# Altium schematic sheet RK3588_DDR.SchDoc
size 594 x 420 mm; SheetNumber: 4; SheetTotal: 24
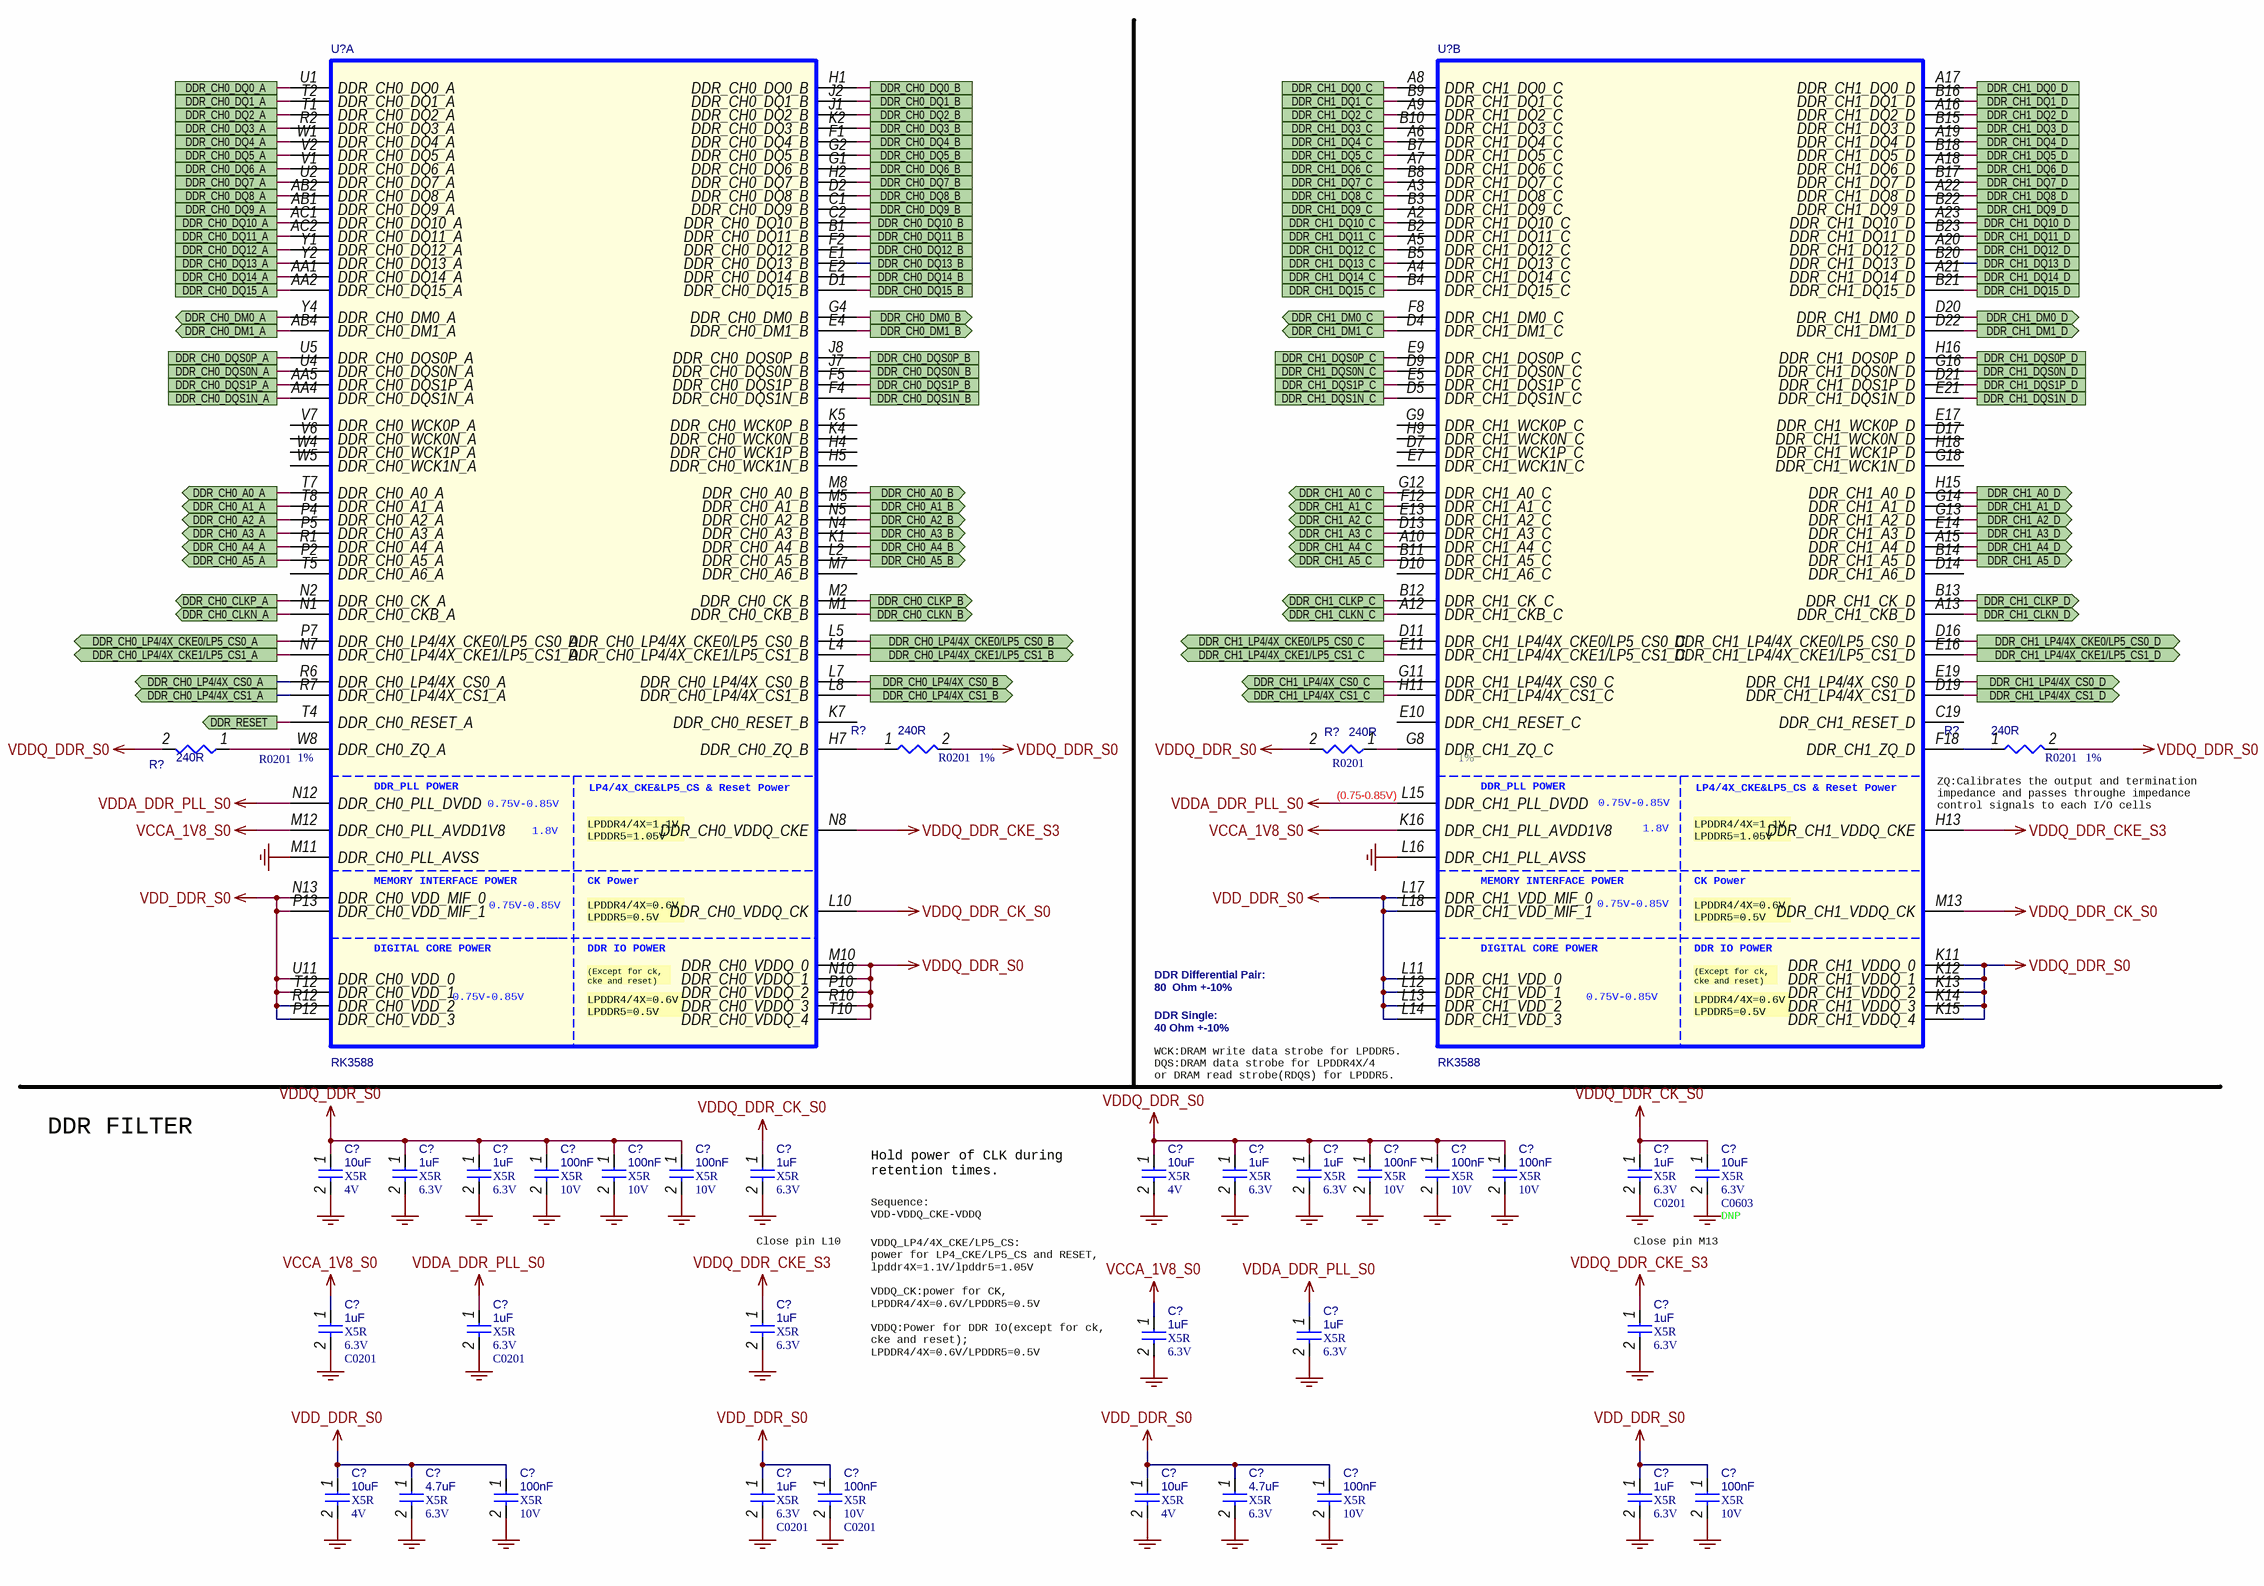
[diagram p0: RK3588_DDR.SchDoc]

## Parts
(Parts that share a designator on the sheet are numbered #1, #2 ... from top to bottom, then left to right.)
C?#1  10uF  Dielectric: X5R  Voltage: 4V  [C0402_BGA]
C?#2  1uF  Dielectric: X5R  Voltage: 6.3V  [C0201]
C?#3  1uF  Dielectric: X5R  Voltage: 6.3V  [C0201]
C?#4  100nF  Dielectric: X5R  Voltage: 10V  [C0201]
C?#5  100nF  Dielectric: X5R  Voltage: 10V  [C0201]
C?#6  100nF  Dielectric: X5R  Voltage: 10V  [C0201]
C?#7  1uF  Dielectric: X5R  Voltage: 6.3V  [C0201]
C?#8  10uF  Dielectric: X5R  Voltage: 4V  [C0402_BGA]
C?#9  1uF  Dielectric: X5R  Voltage: 6.3V  [C0201]
C?#10  1uF  Dielectric: X5R  Voltage: 6.3V  [C0201]
C?#11  100nF  Dielectric: X5R  Voltage: 10V  [C0201]
C?#12  100nF  Dielectric: X5R  Voltage: 10V  [C0201]
C?#13  100nF  Dielectric: X5R  Voltage: 10V  [C0201]
C?#14  1uF  Dielectric: X5R  Voltage: 6.3V  [C0201]
C?#15  10uF  Dielectric: X5R  Voltage: 6.3V  Option: DNP  [C0603]
C?#16  1uF  Dielectric: X5R  Voltage: 6.3V  [C0201]
C?#17  1uF  Dielectric: X5R  Voltage: 6.3V  [C0201]
C?#18  1uF  Dielectric: X5R  Voltage: 6.3V  [C0201]
C?#19  1uF  Dielectric: X5R  Voltage: 6.3V  [C0201]
C?#20  1uF  Dielectric: X5R  Voltage: 6.3V  [C0201]
C?#21  1uF  Dielectric: X5R  Voltage: 6.3V  [C0201]
C?#22  10uF  Dielectric: X5R  Voltage: 4V  [C0402_BGA]
C?#23  4.7uF  Dielectric: X5R  Voltage: 6.3V  [C0402_BGA]
C?#24  100nF  Dielectric: X5R  Voltage: 10V  [C0201]
C?#25  1uF  Dielectric: X5R  Voltage: 6.3V  [C0201]
C?#26  100nF  Dielectric: X5R  Voltage: 10V  [C0201]
C?#27  10uF  Dielectric: X5R  Voltage: 4V  [C0402_BGA]
C?#28  4.7uF  Dielectric: X5R  Voltage: 6.3V  [C0402_BGA]
C?#29  100nF  Dielectric: X5R  Voltage: 10V  [C0201]
C?#30  1uF  Dielectric: X5R  Voltage: 6.3V  [C0201]
C?#31  100nF  Dielectric: X5R  Voltage: 10V  [C0201]
R?#1  240R  Tolerance: 1%  PCB Footprint: R0201  [R0402]
R?#2  240R  Tolerance: 1%  PCB Footprint: R0201  [R0402]
R?#3  240R  Tolerance: 1%  PCB Footprint: R0201  [R0402]
R?#4  240R  Tolerance: 1%  PCB Footprint: R0201  [R0402]
U?#1  RK3588  [BGA1088_23R00X23R00X2R00]  (part A of 26)
U?#2  RK3588  [BGA1088_23R00X23R00X2R00]  (part B of 26)

## Ports
DDR_CH0_A0_A (out, see DRAM_LPDDR4X_200P_2X32bit[1B]), DDR_CH0_A0_B (out, see DRAM_LPDDR4X_200P_2X32bit[2B]), DDR_CH0_A1_A (out, see DRAM_LPDDR4X_200P_2X32bit[1B]), DDR_CH0_A1_B (out, see DRAM_LPDDR4X_200P_2X32bit[2B]), DDR_CH0_A2_A (out, see DRAM_LPDDR4X_200P_2X32bit[1B]), DDR_CH0_A2_B (out, see DRAM_LPDDR4X_200P_2X32bit[2B]), DDR_CH0_A3_A (out, see DRAM_LPDDR4X_200P_2X32bit[1B]), DDR_CH0_A3_B (out, see DRAM_LPDDR4X_200P_2X32bit[2B]), DDR_CH0_A4_A (out, see DRAM_LPDDR4X_200P_2X32bit[1B]), DDR_CH0_A4_B (out, see DRAM_LPDDR4X_200P_2X32bit[2B]), DDR_CH0_A5_A (out, see DRAM_LPDDR4X_200P_2X32bit[1B]), DDR_CH0_A5_B (out, see DRAM_LPDDR4X_200P_2X32bit[2B]), DDR_CH0_CLKN_A (out, see DRAM_LPDDR4X_200P_2X32bit[1B]), DDR_CH0_CLKN_B (out, see DRAM_LPDDR4X_200P_2X32bit[2B]), DDR_CH0_CLKP_A (out, see DRAM_LPDDR4X_200P_2X32bit[1B]), DDR_CH0_CLKP_B (out, see DRAM_LPDDR4X_200P_2X32bit[2B]), DDR_CH0_DM0_A (out, see DRAM_LPDDR4X_200P_2X32bit[1A]), DDR_CH0_DM0_B (out, see DRAM_LPDDR4X_200P_2X32bit[2A]), DDR_CH0_DM1_A (out, see DRAM_LPDDR4X_200P_2X32bit[1B]), DDR_CH0_DM1_B (out, see DRAM_LPDDR4X_200P_2X32bit[2B]), DDR_CH0_DQ0_A (see DRAM_LPDDR4X_200P_2X32bit[1A]), DDR_CH0_DQ0_B (see DRAM_LPDDR4X_200P_2X32bit[2A]), DDR_CH0_DQ1_A (see DRAM_LPDDR4X_200P_2X32bit[1A]), DDR_CH0_DQ1_B (see DRAM_LPDDR4X_200P_2X32bit[2A]), DDR_CH0_DQ2_A (see DRAM_LPDDR4X_200P_2X32bit[1A]), DDR_CH0_DQ2_B (see DRAM_LPDDR4X_200P_2X32bit[2A]), DDR_CH0_DQ3_A (see DRAM_LPDDR4X_200P_2X32bit[1A]), DDR_CH0_DQ3_B (see DRAM_LPDDR4X_200P_2X32bit[2A]), DDR_CH0_DQ4_A (see DRAM_LPDDR4X_200P_2X32bit[1A]), DDR_CH0_DQ4_B (see DRAM_LPDDR4X_200P_2X32bit[2A]), DDR_CH0_DQ5_A (see DRAM_LPDDR4X_200P_2X32bit[1A]), DDR_CH0_DQ5_B (see DRAM_LPDDR4X_200P_2X32bit[2A]), DDR_CH0_DQ6_A (see DRAM_LPDDR4X_200P_2X32bit[1A]), DDR_CH0_DQ6_B (see DRAM_LPDDR4X_200P_2X32bit[2A]), DDR_CH0_DQ7_A (see DRAM_LPDDR4X_200P_2X32bit[1A]), DDR_CH0_DQ7_B (see DRAM_LPDDR4X_200P_2X32bit[2A]), DDR_CH0_DQ8_A (see DRAM_LPDDR4X_200P_2X32bit[1A]), DDR_CH0_DQ8_B (see DRAM_LPDDR4X_200P_2X32bit[2A]), DDR_CH0_DQ9_A (see DRAM_LPDDR4X_200P_2X32bit[1A]), DDR_CH0_DQ9_B (see DRAM_LPDDR4X_200P_2X32bit[2A]), DDR_CH0_DQ10_A (see DRAM_LPDDR4X_200P_2X32bit[1A]), DDR_CH0_DQ10_B (see DRAM_LPDDR4X_200P_2X32bit[2A]), DDR_CH0_DQ11_A (see DRAM_LPDDR4X_200P_2X32bit[1A]), DDR_CH0_DQ11_B (see DRAM_LPDDR4X_200P_2X32bit[2A]), DDR_CH0_DQ12_A (see DRAM_LPDDR4X_200P_2X32bit[1A]), DDR_CH0_DQ12_B (see DRAM_LPDDR4X_200P_2X32bit[2A]), DDR_CH0_DQ13_A (see DRAM_LPDDR4X_200P_2X32bit[1A]), DDR_CH0_DQ13_B (see DRAM_LPDDR4X_200P_2X32bit[2A]), DDR_CH0_DQ14_A (see DRAM_LPDDR4X_200P_2X32bit[1A]), DDR_CH0_DQ14_B (see DRAM_LPDDR4X_200P_2X32bit[2A]), DDR_CH0_DQ15_A (see DRAM_LPDDR4X_200P_2X32bit[1A]), DDR_CH0_DQ15_B (see DRAM_LPDDR4X_200P_2X32bit[2A]), DDR_CH0_DQS0N_A (see DRAM_LPDDR4X_200P_2X32bit[1A]), DDR_CH0_DQS0N_B (see DRAM_LPDDR4X_200P_2X32bit[2A]), DDR_CH0_DQS0P_A (see DRAM_LPDDR4X_200P_2X32bit[1A]), DDR_CH0_DQS0P_B (see DRAM_LPDDR4X_200P_2X32bit[2A]), DDR_CH0_DQS1N_A (see DRAM_LPDDR4X_200P_2X32bit[1B]), DDR_CH0_DQS1N_B (see DRAM_LPDDR4X_200P_2X32bit[2B]), DDR_CH0_DQS1P_A (see DRAM_LPDDR4X_200P_2X32bit[1B]), DDR_CH0_DQS1P_B (see DRAM_LPDDR4X_200P_2X32bit[2B]), DDR_CH0_LP4/4X_CKE0/LP5_CS0_A (out, see DRAM_LPDDR4X_200P_2X32bit[3B]), DDR_CH0_LP4/4X_CKE0/LP5_CS0_B (out, see DRAM_LPDDR4X_200P_2X32bit[3B]), DDR_CH0_LP4/4X_CKE1/LP5_CS1_A (out, see DRAM_LPDDR4X_200P_2X32bit[3B]), DDR_CH0_LP4/4X_CKE1/LP5_CS1_B (out, see DRAM_LPDDR4X_200P_2X32bit[3B]), DDR_CH0_LP4/4X_CS0_A (out, see DRAM_LPDDR4X_200P_2X32bit[1B]), DDR_CH0_LP4/4X_CS0_B (out, see DRAM_LPDDR4X_200P_2X32bit[2B]), DDR_CH0_LP4/4X_CS1_A (out, see DRAM_LPDDR4X_200P_2X32bit[1B]), DDR_CH0_LP4/4X_CS1_B (out, see DRAM_LPDDR4X_200P_2X32bit[2B]), DDR_CH1_A0_C (out, see DRAM_LPDDR4X_200P_2X32bit[1C]), DDR_CH1_A0_D (out, see DRAM_LPDDR4X_200P_2X32bit[2C]), DDR_CH1_A1_C (out, see DRAM_LPDDR4X_200P_2X32bit[1C]), DDR_CH1_A1_D (out, see DRAM_LPDDR4X_200P_2X32bit[2C]), DDR_CH1_A2_C (out, see DRAM_LPDDR4X_200P_2X32bit[1C]), DDR_CH1_A2_D (out, see DRAM_LPDDR4X_200P_2X32bit[2C]), DDR_CH1_A3_C (out, see DRAM_LPDDR4X_200P_2X32bit[1C]), DDR_CH1_A3_D (out, see DRAM_LPDDR4X_200P_2X32bit[2C]), DDR_CH1_A4_C (out, see DRAM_LPDDR4X_200P_2X32bit[1C]), DDR_CH1_A4_D (out, see DRAM_LPDDR4X_200P_2X32bit[2C]), DDR_CH1_A5_C (out, see DRAM_LPDDR4X_200P_2X32bit[1D]), DDR_CH1_A5_D (out, see DRAM_LPDDR4X_200P_2X32bit[2D]), DDR_CH1_CLKN_C (out, see DRAM_LPDDR4X_200P_2X32bit[1D]), DDR_CH1_CLKN_D (out, see DRAM_LPDDR4X_200P_2X32bit[2D]), DDR_CH1_CLKP_C (out, see DRAM_LPDDR4X_200P_2X32bit[1D]), DDR_CH1_CLKP_D (out, see DRAM_LPDDR4X_200P_2X32bit[2D]), DDR_CH1_DM0_C (out, see DRAM_LPDDR4X_200P_2X32bit[1C]), DDR_CH1_DM0_D (out, see DRAM_LPDDR4X_200P_2X32bit[2C]), DDR_CH1_DM1_C (out, see DRAM_LPDDR4X_200P_2X32bit[1C]), DDR_CH1_DM1_D (out, see DRAM_LPDDR4X_200P_2X32bit[2C]), DDR_CH1_DQ0_C (see DRAM_LPDDR4X_200P_2X32bit[1C]), DDR_CH1_DQ0_D (see DRAM_LPDDR4X_200P_2X32bit[2C]), DDR_CH1_DQ1_C (see DRAM_LPDDR4X_200P_2X32bit[1C]), DDR_CH1_DQ1_D (see DRAM_LPDDR4X_200P_2X32bit[2C]), DDR_CH1_DQ2_C (see DRAM_LPDDR4X_200P_2X32bit[1C]), DDR_CH1_DQ2_D (see DRAM_LPDDR4X_200P_2X32bit[2C]), DDR_CH1_DQ3_C (see DRAM_LPDDR4X_200P_2X32bit[1C]), DDR_CH1_DQ3_D (see DRAM_LPDDR4X_200P_2X32bit[2C]), DDR_CH1_DQ4_C (see DRAM_LPDDR4X_200P_2X32bit[1C]), DDR_CH1_DQ4_D (see DRAM_LPDDR4X_200P_2X32bit[2C]), DDR_CH1_DQ5_C (see DRAM_LPDDR4X_200P_2X32bit[1C]), DDR_CH1_DQ5_D (see DRAM_LPDDR4X_200P_2X32bit[2C]), DDR_CH1_DQ6_C (see DRAM_LPDDR4X_200P_2X32bit[1C]), DDR_CH1_DQ6_D (see DRAM_LPDDR4X_200P_2X32bit[2C]), DDR_CH1_DQ7_C (see DRAM_LPDDR4X_200P_2X32bit[1C]), DDR_CH1_DQ7_D (see DRAM_LPDDR4X_200P_2X32bit[2C]), DDR_CH1_DQ8_C (see DRAM_LPDDR4X_200P_2X32bit[1C]), DDR_CH1_DQ8_D (see DRAM_LPDDR4X_200P_2X32bit[2C]), DDR_CH1_DQ9_C (see DRAM_LPDDR4X_200P_2X32bit[1C]), DDR_CH1_DQ9_D (see DRAM_LPDDR4X_200P_2X32bit[2C]), DDR_CH1_DQ10_C (see DRAM_LPDDR4X_200P_2X32bit[1C]), DDR_CH1_DQ10_D (see DRAM_LPDDR4X_200P_2X32bit[2C]), DDR_CH1_DQ11_C (see DRAM_LPDDR4X_200P_2X32bit[1C]), DDR_CH1_DQ11_D (see DRAM_LPDDR4X_200P_2X32bit[2C]), DDR_CH1_DQ12_C (see DRAM_LPDDR4X_200P_2X32bit[1C]), DDR_CH1_DQ12_D (see DRAM_LPDDR4X_200P_2X32bit[2C]), DDR_CH1_DQ13_C (see DRAM_LPDDR4X_200P_2X32bit[1C]), DDR_CH1_DQ13_D (see DRAM_LPDDR4X_200P_2X32bit[2C]), DDR_CH1_DQ14_C (see DRAM_LPDDR4X_200P_2X32bit[1C]), DDR_CH1_DQ14_D (see DRAM_LPDDR4X_200P_2X32bit[2C]), DDR_CH1_DQ15_C (see DRAM_LPDDR4X_200P_2X32bit[1C]), DDR_CH1_DQ15_D (see DRAM_LPDDR4X_200P_2X32bit[2C]), DDR_CH1_DQS0N_C (see DRAM_LPDDR4X_200P_2X32bit[1C]), DDR_CH1_DQS0N_D (see DRAM_LPDDR4X_200P_2X32bit[2C]), DDR_CH1_DQS0P_C (see DRAM_LPDDR4X_200P_2X32bit[1C]), DDR_CH1_DQS0P_D (see DRAM_LPDDR4X_200P_2X32bit[2C]), DDR_CH1_DQS1N_C (see DRAM_LPDDR4X_200P_2X32bit[1C]), DDR_CH1_DQS1N_D (see DRAM_LPDDR4X_200P_2X32bit[2C]), DDR_CH1_DQS1P_C (see DRAM_LPDDR4X_200P_2X32bit[1C]), DDR_CH1_DQS1P_D (see DRAM_LPDDR4X_200P_2X32bit[2C]), DDR_CH1_LP4/4X_CKE0/LP5_CS0_C (out, see DRAM_LPDDR4X_200P_2X32bit[3D]), DDR_CH1_LP4/4X_CKE0/LP5_CS0_D (out, see DRAM_LPDDR4X_200P_2X32bit[3D]), DDR_CH1_LP4/4X_CKE1/LP5_CS1_C (out, see DRAM_LPDDR4X_200P_2X32bit[3D]), DDR_CH1_LP4/4X_CKE1/LP5_CS1_D (out, see DRAM_LPDDR4X_200P_2X32bit[3D]), DDR_CH1_LP4/4X_CS0_C (out, see DRAM_LPDDR4X_200P_2X32bit[1D]), DDR_CH1_LP4/4X_CS0_D (out, see DRAM_LPDDR4X_200P_2X32bit[2D]), DDR_CH1_LP4/4X_CS1_C (out, see DRAM_LPDDR4X_200P_2X32bit[1D]), DDR_CH1_LP4/4X_CS1_D (out, see DRAM_LPDDR4X_200P_2X32bit[2D]), DDR_RESET (out, see DRAM_LPDDR4X_200P_2X32bit[2B])

## Nets
(0.75-0.85V): C?#17.1 C?#21.1 U?#1.N12(DDR_CH0_PLL_DVDD) U?#2.L15(DDR_CH1_PLL_DVDD)  [also labelled VDDA_DDR_PLL_S0]
GND: C?#1.2 C?#2.2 C?#3.2 C?#4.2 C?#5.2 C?#6.2 C?#7.2 C?#8.2 C?#9.2 C?#10.2 C?#11.2 C?#12.2 C?#13.2 C?#14.2 C?#15.2 C?#16.2 C?#17.2 C?#18.2 C?#19.2 C?#20.2 C?#21.2 C?#22.2 C?#23.2 C?#24.2 C?#25.2 C?#26.2 C?#27.2 C?#28.2 C?#29.2 C?#30.2 C?#31.2 U?#1.M11(DDR_CH0_PLL_AVSS) U?#2.L16(DDR_CH1_PLL_AVSS)
VCCA_1V8_S0: C?#16.1 C?#20.1 U?#1.M12(DDR_CH0_PLL_AVDD1V8) U?#2.K16(DDR_CH1_PLL_AVDD1V8)
VDD_DDR_S0: C?#22.1 C?#23.1 C?#24.1 C?#25.1 C?#26.1 C?#27.1 C?#28.1 C?#29.1 C?#30.1 C?#31.1 U?#1.N13(DDR_CH0_VDD_MIF_0) U?#1.P12(DDR_CH0_VDD_3) U?#1.P13(DDR_CH0_VDD_MIF_1) U?#1.R12(DDR_CH0_VDD_2) U?#1.T12(DDR_CH0_VDD_1) U?#1.U11(DDR_CH0_VDD_0) U?#2.L11(DDR_CH1_VDD_0) U?#2.L12(DDR_CH1_VDD_1) U?#2.L13(DDR_CH1_VDD_2) U?#2.L14(DDR_CH1_VDD_3) U?#2.L17(DDR_CH1_VDD_MIF_0) U?#2.L18(DDR_CH1_VDD_MIF_1)
VDDQ_DDR_CK_S0: C?#7.1 C?#14.1 C?#15.1 U?#1.L10(DDR_CH0_VDDQ_CK) U?#2.M13(DDR_CH1_VDDQ_CK)
VDDQ_DDR_CKE_S3: C?#18.1 C?#19.1 U?#1.N8(DDR_CH0_VDDQ_CKE) U?#2.H13(DDR_CH1_VDDQ_CKE)
VDDQ_DDR_S0: C?#1.1 C?#2.1 C?#3.1 C?#4.1 C?#5.1 C?#6.1 C?#8.1 C?#9.1 C?#10.1 C?#11.1 C?#12.1 C?#13.1 R?#1.2 R?#2.2 R?#3.2 R?#4.2 U?#1.M10(DDR_CH0_VDDQ_0) U?#1.N10(DDR_CH0_VDDQ_1) U?#1.P10(DDR_CH0_VDDQ_2) U?#1.R10(DDR_CH0_VDDQ_3) U?#1.T10(DDR_CH0_VDDQ_4) U?#2.K11(DDR_CH1_VDDQ_0) U?#2.K12(DDR_CH1_VDDQ_1) U?#2.K13(DDR_CH1_VDDQ_2) U?#2.K14(DDR_CH1_VDDQ_3) U?#2.K15(DDR_CH1_VDDQ_4)
DDR_CH0_A0_A: U?#1.T7(DDR_CH0_A0_A) ; port DDR_CH0_A0_A
DDR_CH0_A0_B: U?#1.M8(DDR_CH0_A0_B) ; port DDR_CH0_A0_B
DDR_CH0_A1_A: U?#1.T8(DDR_CH0_A1_A) ; port DDR_CH0_A1_A
DDR_CH0_A1_B: U?#1.M5(DDR_CH0_A1_B) ; port DDR_CH0_A1_B
DDR_CH0_A2_A: U?#1.P4(DDR_CH0_A2_A) ; port DDR_CH0_A2_A
DDR_CH0_A2_B: U?#1.N5(DDR_CH0_A2_B) ; port DDR_CH0_A2_B
DDR_CH0_A3_A: U?#1.P5(DDR_CH0_A3_A) ; port DDR_CH0_A3_A
DDR_CH0_A3_B: U?#1.N4(DDR_CH0_A3_B) ; port DDR_CH0_A3_B
DDR_CH0_A4_A: U?#1.R1(DDR_CH0_A4_A) ; port DDR_CH0_A4_A
DDR_CH0_A4_B: U?#1.K1(DDR_CH0_A4_B) ; port DDR_CH0_A4_B
DDR_CH0_A5_A: U?#1.P2(DDR_CH0_A5_A) ; port DDR_CH0_A5_A
DDR_CH0_A5_B: U?#1.L2(DDR_CH0_A5_B) ; port DDR_CH0_A5_B
DDR_CH0_CLKN_A: U?#1.N1(DDR_CH0_CKB_A) ; port DDR_CH0_CLKN_A
DDR_CH0_CLKN_B: U?#1.M1(DDR_CH0_CKB_B) ; port DDR_CH0_CLKN_B
DDR_CH0_CLKP_A: U?#1.N2(DDR_CH0_CK_A) ; port DDR_CH0_CLKP_A
DDR_CH0_CLKP_B: U?#1.M2(DDR_CH0_CK_B) ; port DDR_CH0_CLKP_B
DDR_CH0_DM0_A: U?#1.Y4(DDR_CH0_DM0_A) ; port DDR_CH0_DM0_A
DDR_CH0_DM0_B: U?#1.G4(DDR_CH0_DM0_B) ; port DDR_CH0_DM0_B
DDR_CH0_DM1_A: U?#1.AB4(DDR_CH0_DM1_A) ; port DDR_CH0_DM1_A
DDR_CH0_DM1_B: U?#1.E4(DDR_CH0_DM1_B) ; port DDR_CH0_DM1_B
DDR_CH0_DQ0_A: U?#1.U1(DDR_CH0_DQ0_A) ; port DDR_CH0_DQ0_A
DDR_CH0_DQ0_B: U?#1.H1(DDR_CH0_DQ0_B) ; port DDR_CH0_DQ0_B
DDR_CH0_DQ1_A: U?#1.T2(DDR_CH0_DQ1_A) ; port DDR_CH0_DQ1_A
DDR_CH0_DQ1_B: U?#1.J2(DDR_CH0_DQ1_B) ; port DDR_CH0_DQ1_B
DDR_CH0_DQ2_A: U?#1.T1(DDR_CH0_DQ2_A) ; port DDR_CH0_DQ2_A
DDR_CH0_DQ2_B: U?#1.J1(DDR_CH0_DQ2_B) ; port DDR_CH0_DQ2_B
DDR_CH0_DQ3_A: U?#1.R2(DDR_CH0_DQ3_A) ; port DDR_CH0_DQ3_A
DDR_CH0_DQ3_B: U?#1.K2(DDR_CH0_DQ3_B) ; port DDR_CH0_DQ3_B
DDR_CH0_DQ4_A: U?#1.W1(DDR_CH0_DQ4_A) ; port DDR_CH0_DQ4_A
DDR_CH0_DQ4_B: U?#1.F1(DDR_CH0_DQ4_B) ; port DDR_CH0_DQ4_B
DDR_CH0_DQ5_A: U?#1.V2(DDR_CH0_DQ5_A) ; port DDR_CH0_DQ5_A
DDR_CH0_DQ5_B: U?#1.G2(DDR_CH0_DQ5_B) ; port DDR_CH0_DQ5_B
DDR_CH0_DQ6_A: U?#1.V1(DDR_CH0_DQ6_A) ; port DDR_CH0_DQ6_A
DDR_CH0_DQ6_B: U?#1.G1(DDR_CH0_DQ6_B) ; port DDR_CH0_DQ6_B
DDR_CH0_DQ7_A: U?#1.U2(DDR_CH0_DQ7_A) ; port DDR_CH0_DQ7_A
DDR_CH0_DQ7_B: U?#1.H2(DDR_CH0_DQ7_B) ; port DDR_CH0_DQ7_B
DDR_CH0_DQ8_A: U?#1.AB2(DDR_CH0_DQ8_A) ; port DDR_CH0_DQ8_A
DDR_CH0_DQ8_B: U?#1.D2(DDR_CH0_DQ8_B) ; port DDR_CH0_DQ8_B
DDR_CH0_DQ9_A: U?#1.AB1(DDR_CH0_DQ9_A) ; port DDR_CH0_DQ9_A
DDR_CH0_DQ9_B: U?#1.C1(DDR_CH0_DQ9_B) ; port DDR_CH0_DQ9_B
DDR_CH0_DQ10_A: U?#1.AC1(DDR_CH0_DQ10_A) ; port DDR_CH0_DQ10_A
DDR_CH0_DQ10_B: U?#1.C2(DDR_CH0_DQ10_B) ; port DDR_CH0_DQ10_B
DDR_CH0_DQ11_A: U?#1.AC2(DDR_CH0_DQ11_A) ; port DDR_CH0_DQ11_A
DDR_CH0_DQ11_B: U?#1.B1(DDR_CH0_DQ11_B) ; port DDR_CH0_DQ11_B
DDR_CH0_DQ12_A: U?#1.Y1(DDR_CH0_DQ12_A) ; port DDR_CH0_DQ12_A
DDR_CH0_DQ12_B: U?#1.F2(DDR_CH0_DQ12_B) ; port DDR_CH0_DQ12_B
DDR_CH0_DQ13_A: U?#1.Y2(DDR_CH0_DQ13_A) ; port DDR_CH0_DQ13_A
DDR_CH0_DQ13_B: U?#1.E1(DDR_CH0_DQ13_B) ; port DDR_CH0_DQ13_B
DDR_CH0_DQ14_A: U?#1.AA1(DDR_CH0_DQ14_A) ; port DDR_CH0_DQ14_A
DDR_CH0_DQ14_B: U?#1.E2(DDR_CH0_DQ14_B) ; port DDR_CH0_DQ14_B
DDR_CH0_DQ15_A: U?#1.AA2(DDR_CH0_DQ15_A) ; port DDR_CH0_DQ15_A
DDR_CH0_DQ15_B: U?#1.D1(DDR_CH0_DQ15_B) ; port DDR_CH0_DQ15_B
DDR_CH0_DQS0N_A: U?#1.U4(DDR_CH0_DQS0N_A) ; port DDR_CH0_DQS0N_A
DDR_CH0_DQS0N_B: U?#1.J7(DDR_CH0_DQS0N_B) ; port DDR_CH0_DQS0N_B
DDR_CH0_DQS0P_A: U?#1.U5(DDR_CH0_DQS0P_A) ; port DDR_CH0_DQS0P_A
DDR_CH0_DQS0P_B: U?#1.J8(DDR_CH0_DQS0P_B) ; port DDR_CH0_DQS0P_B
DDR_CH0_DQS1N_A: U?#1.AA4(DDR_CH0_DQS1N_A) ; port DDR_CH0_DQS1N_A
DDR_CH0_DQS1N_B: U?#1.F4(DDR_CH0_DQS1N_B) ; port DDR_CH0_DQS1N_B
DDR_CH0_DQS1P_A: U?#1.AA5(DDR_CH0_DQS1P_A) ; port DDR_CH0_DQS1P_A
DDR_CH0_DQS1P_B: U?#1.F5(DDR_CH0_DQS1P_B) ; port DDR_CH0_DQS1P_B
DDR_CH0_LP4/4X_CKE0/LP5_CS0_A: U?#1.P7(DDR_CH0_LP4/4X_CKE0/LP5_CS0_A) ; port DDR_CH0_LP4/4X_CKE0/LP5_CS0_A
DDR_CH0_LP4/4X_CKE0/LP5_CS0_B: U?#1.L5(DDR_CH0_LP4/4X_CKE0/LP5_CS0_B) ; port DDR_CH0_LP4/4X_CKE0/LP5_CS0_B
DDR_CH0_LP4/4X_CKE1/LP5_CS1_A: U?#1.N7(DDR_CH0_LP4/4X_CKE1/LP5_CS1_A) ; port DDR_CH0_LP4/4X_CKE1/LP5_CS1_A
DDR_CH0_LP4/4X_CKE1/LP5_CS1_B: U?#1.L4(DDR_CH0_LP4/4X_CKE1/LP5_CS1_B) ; port DDR_CH0_LP4/4X_CKE1/LP5_CS1_B
DDR_CH0_LP4/4X_CS0_A: U?#1.R6(DDR_CH0_LP4/4X_CS0_A) ; port DDR_CH0_LP4/4X_CS0_A
DDR_CH0_LP4/4X_CS0_B: U?#1.L7(DDR_CH0_LP4/4X_CS0_B) ; port DDR_CH0_LP4/4X_CS0_B
DDR_CH0_LP4/4X_CS1_A: U?#1.R7(DDR_CH0_LP4/4X_CS1_A) ; port DDR_CH0_LP4/4X_CS1_A
DDR_CH0_LP4/4X_CS1_B: U?#1.L8(DDR_CH0_LP4/4X_CS1_B) ; port DDR_CH0_LP4/4X_CS1_B
DDR_CH1_A0_C: U?#2.G12(DDR_CH1_A0_C) ; port DDR_CH1_A0_C
DDR_CH1_A0_D: U?#2.H15(DDR_CH1_A0_D) ; port DDR_CH1_A0_D
DDR_CH1_A1_C: U?#2.F12(DDR_CH1_A1_C) ; port DDR_CH1_A1_C
DDR_CH1_A1_D: U?#2.G14(DDR_CH1_A1_D) ; port DDR_CH1_A1_D
DDR_CH1_A2_C: U?#2.E13(DDR_CH1_A2_C) ; port DDR_CH1_A2_C
DDR_CH1_A2_D: U?#2.G13(DDR_CH1_A2_D) ; port DDR_CH1_A2_D
DDR_CH1_A3_C: U?#2.D13(DDR_CH1_A3_C) ; port DDR_CH1_A3_C
DDR_CH1_A3_D: U?#2.E14(DDR_CH1_A3_D) ; port DDR_CH1_A3_D
DDR_CH1_A4_C: U?#2.A10(DDR_CH1_A4_C) ; port DDR_CH1_A4_C
DDR_CH1_A4_D: U?#2.A15(DDR_CH1_A4_D) ; port DDR_CH1_A4_D
DDR_CH1_A5_C: U?#2.B11(DDR_CH1_A5_C) ; port DDR_CH1_A5_C
DDR_CH1_A5_D: U?#2.B14(DDR_CH1_A5_D) ; port DDR_CH1_A5_D
DDR_CH1_CLKN_C: U?#2.A12(DDR_CH1_CKB_C) ; port DDR_CH1_CLKN_C
DDR_CH1_CLKN_D: U?#2.A13(DDR_CH1_CKB_D) ; port DDR_CH1_CLKN_D
DDR_CH1_CLKP_C: U?#2.B12(DDR_CH1_CK_C) ; port DDR_CH1_CLKP_C
DDR_CH1_CLKP_D: U?#2.B13(DDR_CH1_CK_D) ; port DDR_CH1_CLKP_D
DDR_CH1_DM0_C: U?#2.F8(DDR_CH1_DM0_C) ; port DDR_CH1_DM0_C
DDR_CH1_DM0_D: U?#2.D20(DDR_CH1_DM0_D) ; port DDR_CH1_DM0_D
DDR_CH1_DM1_C: U?#2.D4(DDR_CH1_DM1_C) ; port DDR_CH1_DM1_C
DDR_CH1_DM1_D: U?#2.D22(DDR_CH1_DM1_D) ; port DDR_CH1_DM1_D
DDR_CH1_DQ0_C: U?#2.A8(DDR_CH1_DQ0_C) ; port DDR_CH1_DQ0_C
DDR_CH1_DQ0_D: U?#2.A17(DDR_CH1_DQ0_D) ; port DDR_CH1_DQ0_D
DDR_CH1_DQ1_C: U?#2.B9(DDR_CH1_DQ1_C) ; port DDR_CH1_DQ1_C
DDR_CH1_DQ1_D: U?#2.B16(DDR_CH1_DQ1_D) ; port DDR_CH1_DQ1_D
DDR_CH1_DQ2_C: U?#2.A9(DDR_CH1_DQ2_C) ; port DDR_CH1_DQ2_C
DDR_CH1_DQ2_D: U?#2.A16(DDR_CH1_DQ2_D) ; port DDR_CH1_DQ2_D
DDR_CH1_DQ3_C: U?#2.B10(DDR_CH1_DQ3_C) ; port DDR_CH1_DQ3_C
DDR_CH1_DQ3_D: U?#2.B15(DDR_CH1_DQ3_D) ; port DDR_CH1_DQ3_D
DDR_CH1_DQ4_C: U?#2.A6(DDR_CH1_DQ4_C) ; port DDR_CH1_DQ4_C
DDR_CH1_DQ4_D: U?#2.A19(DDR_CH1_DQ4_D) ; port DDR_CH1_DQ4_D
DDR_CH1_DQ5_C: U?#2.B7(DDR_CH1_DQ5_C) ; port DDR_CH1_DQ5_C
DDR_CH1_DQ5_D: U?#2.B18(DDR_CH1_DQ5_D) ; port DDR_CH1_DQ5_D
DDR_CH1_DQ6_C: U?#2.A7(DDR_CH1_DQ6_C) ; port DDR_CH1_DQ6_C
DDR_CH1_DQ6_D: U?#2.A18(DDR_CH1_DQ6_D) ; port DDR_CH1_DQ6_D
DDR_CH1_DQ7_C: U?#2.B8(DDR_CH1_DQ7_C) ; port DDR_CH1_DQ7_C
DDR_CH1_DQ7_D: U?#2.B17(DDR_CH1_DQ7_D) ; port DDR_CH1_DQ7_D
DDR_CH1_DQ8_C: U?#2.A3(DDR_CH1_DQ8_C) ; port DDR_CH1_DQ8_C
DDR_CH1_DQ8_D: U?#2.A22(DDR_CH1_DQ8_D) ; port DDR_CH1_DQ8_D
DDR_CH1_DQ9_C: U?#2.B3(DDR_CH1_DQ9_C) ; port DDR_CH1_DQ9_C
DDR_CH1_DQ9_D: U?#2.B22(DDR_CH1_DQ9_D) ; port DDR_CH1_DQ9_D
DDR_CH1_DQ10_C: U?#2.A2(DDR_CH1_DQ10_C) ; port DDR_CH1_DQ10_C
DDR_CH1_DQ10_D: U?#2.A23(DDR_CH1_DQ10_D) ; port DDR_CH1_DQ10_D
DDR_CH1_DQ11_C: U?#2.B2(DDR_CH1_DQ11_C) ; port DDR_CH1_DQ11_C
DDR_CH1_DQ11_D: U?#2.B23(DDR_CH1_DQ11_D) ; port DDR_CH1_DQ11_D
DDR_CH1_DQ12_C: U?#2.A5(DDR_CH1_DQ12_C) ; port DDR_CH1_DQ12_C
DDR_CH1_DQ12_D: U?#2.A20(DDR_CH1_DQ12_D) ; port DDR_CH1_DQ12_D
DDR_CH1_DQ13_C: U?#2.B5(DDR_CH1_DQ13_C) ; port DDR_CH1_DQ13_C
DDR_CH1_DQ13_D: U?#2.B20(DDR_CH1_DQ13_D) ; port DDR_CH1_DQ13_D
DDR_CH1_DQ14_C: U?#2.A4(DDR_CH1_DQ14_C) ; port DDR_CH1_DQ14_C
DDR_CH1_DQ14_D: U?#2.A21(DDR_CH1_DQ14_D) ; port DDR_CH1_DQ14_D
DDR_CH1_DQ15_C: U?#2.B4(DDR_CH1_DQ15_C) ; port DDR_CH1_DQ15_C
DDR_CH1_DQ15_D: U?#2.B21(DDR_CH1_DQ15_D) ; port DDR_CH1_DQ15_D
DDR_CH1_DQS0N_C: U?#2.D9(DDR_CH1_DQS0N_C) ; port DDR_CH1_DQS0N_C
DDR_CH1_DQS0N_D: U?#2.G16(DDR_CH1_DQS0N_D) ; port DDR_CH1_DQS0N_D
DDR_CH1_DQS0P_C: U?#2.E9(DDR_CH1_DQS0P_C) ; port DDR_CH1_DQS0P_C
DDR_CH1_DQS0P_D: U?#2.H16(DDR_CH1_DQS0P_D) ; port DDR_CH1_DQS0P_D
DDR_CH1_DQS1N_C: U?#2.D5(DDR_CH1_DQS1N_C) ; port DDR_CH1_DQS1N_C
DDR_CH1_DQS1N_D: U?#2.E21(DDR_CH1_DQS1N_D) ; port DDR_CH1_DQS1N_D
DDR_CH1_DQS1P_C: U?#2.E5(DDR_CH1_DQS1P_C) ; port DDR_CH1_DQS1P_C
DDR_CH1_DQS1P_D: U?#2.D21(DDR_CH1_DQS1P_D) ; port DDR_CH1_DQS1P_D
DDR_CH1_LP4/4X_CKE0/LP5_CS0_C: U?#2.D11(DDR_CH1_LP4/4X_CKE0/LP5_CS0_C) ; port DDR_CH1_LP4/4X_CKE0/LP5_CS0_C
DDR_CH1_LP4/4X_CKE0/LP5_CS0_D: U?#2.D16(DDR_CH1_LP4/4X_CKE0/LP5_CS0_D) ; port DDR_CH1_LP4/4X_CKE0/LP5_CS0_D
DDR_CH1_LP4/4X_CKE1/LP5_CS1_C: U?#2.E11(DDR_CH1_LP4/4X_CKE1/LP5_CS1_C) ; port DDR_CH1_LP4/4X_CKE1/LP5_CS1_C
DDR_CH1_LP4/4X_CKE1/LP5_CS1_D: U?#2.E16(DDR_CH1_LP4/4X_CKE1/LP5_CS1_D) ; port DDR_CH1_LP4/4X_CKE1/LP5_CS1_D
DDR_CH1_LP4/4X_CS0_C: U?#2.G11(DDR_CH1_LP4/4X_CS0_C) ; port DDR_CH1_LP4/4X_CS0_C
DDR_CH1_LP4/4X_CS0_D: U?#2.E19(DDR_CH1_LP4/4X_CS0_D) ; port DDR_CH1_LP4/4X_CS0_D
DDR_CH1_LP4/4X_CS1_C: U?#2.H11(DDR_CH1_LP4/4X_CS1_C) ; port DDR_CH1_LP4/4X_CS1_C
DDR_CH1_LP4/4X_CS1_D: U?#2.D19(DDR_CH1_LP4/4X_CS1_D) ; port DDR_CH1_LP4/4X_CS1_D
DDR_RESET: U?#1.T4(DDR_CH0_RESET_A) ; port DDR_RESET
NetR?#1_1: R?#1.1 U?#1.W8(DDR_CH0_ZQ_A)
NetR?#2_1: R?#2.1 U?#2.G8(DDR_CH1_ZQ_C)
NetR?#3_1: R?#3.1 U?#1.H7(DDR_CH0_ZQ_B)
NetR?#4_1: R?#4.1 U?#2.F18(DDR_CH1_ZQ_D)

Not connected (* = marked no-connect by the designer): U?#1 H4(DDR_CH0_WCK1P_B) H5(DDR_CH0_WCK1N_B) K4(DDR_CH0_WCK0N_B) K5(DDR_CH0_WCK0P_B) K7(DDR_CH0_RESET_B) M7(DDR_CH0_A6_B) T5(DDR_CH0_A6_A) V6(DDR_CH0_WCK0N_A) V7(DDR_CH0_WCK0P_A) W4(DDR_CH0_WCK1P_A) W5(DDR_CH0_WCK1N_A); U?#2 C19(DDR_CH1_RESET_D) D7(DDR_CH1_WCK1P_C) D10(DDR_CH1_A6_C) D14(DDR_CH1_A6_D) D17(DDR_CH1_WCK0N_D) E7(DDR_CH1_WCK1N_C) E10(DDR_CH1_RESET_C) E17(DDR_CH1_WCK0P_D) G9(DDR_CH1_WCK0P_C) G18(DDR_CH1_WCK1N_D) H9(DDR_CH1_WCK0N_C) H18(DDR_CH1_WCK1P_D)

## Notes on the sheet
- ZQ:Calibrates the output and termination
  impedance and passes throughe impedance
  control signals to each I/O cells
- DDR Differential Pair:
  80  Ohm +-10%
- DDR Single:
  40 Ohm +-10%
- DDR FILTER
- (near U?#2) WCK:DRAM write data strobe for LPDDR5.
  DQS:DRAM data strobe for LPDDR4X/4
  or DRAM read strobe(RDQS) for LPDDR5.
- Hold power of CLK during
  retention times.
- Close pin L10
- Sequence:
  VDD-VDDQ_CKE-VDDQ
- Close pin M13
- (near C?#20) VDDQ_LP4/4X_CKE/LP5_CS:
  power for LP4_CKE/LP5_CS and RESET,
  lpddr4X=1.1V/lpddr5=1.05V
  VDDQ_CK:power for CK,
  LPDDR4/4X=0.6V/LPDDR5=0.5V
  VDDQ:Power for DDR IO(except for ck,
  cke and reset);
  LPDDR4/4X=0.6V/LPDDR5=0.5V
- 420x594
- Формат А2
- (in symbol SOC_RK3588, part A) DDR_PLL POWER; LP4/4X_CKE&LP5_CS & Reset Power; 0.75V-0.85V; 1.8V; LPDDR4/4X=1.1V / LPDDR5=1.05V; MEMORY INTERFACE POWER; CK Power; LPDDR4/4X=0.6V / LPDDR5=0.5V; DIGITAL CORE POWER; DDR IO POWER; (Except for ck, / cke and reset)
- (in symbol SOC_RK3588, part B) DDR_PLL POWER; LP4/4X_CKE&LP5_CS & Reset Power; 0.75V-0.85V; 1.8V; LPDDR4/4X=1.1V / LPDDR5=1.05V; MEMORY INTERFACE POWER; CK Power; LPDDR4/4X=0.6V / LPDDR5=0.5V; DIGITAL CORE POWER; DDR IO POWER; (Except for ck, / cke and reset)

## Library data of the parts
C?#1 = CAP NP_Dup1: cap,10.00uF,+/-20%,4V,X5R,C0402; Part Reference: C1200; Manufacturer PN: CC0402MRX5R4BB106; Manufacturer: YAGEO; Tolerance: 20%; C_Voltage: 6.3V; Priority: A; Value: 10uF; Created by: JJJ; Part Type: C0402; RK PN: CC0402MRX5R4BB106
C?#2 = CAP NP_Dup1: cap,1.00uF,+/-20%,6.3V,X5R,C0201; Part Reference: C1201; Manufacturer PN: C0603X5R0J105M030BC; Manufacturer: TDK; Tolerance: 20%; Priority: A; Value: 1uF; Created by: JJJ; Part Type: C0201; RK PN: C0603X5R0J105M030BC
C?#3 = CAP NP_Dup1: cap,1.00uF,+/-20%,6.3V,X5R,C0201; Part Reference: C1202; Manufacturer: TDK; RK PN: C0603X5R0J105M030BC; Priority: A; Tolerance: 20%; Value: 1uF; Part Type: C0201; Manufacturer PN: C0603X5R0J105M030BC; Created by: JJJ
C?#4 = CAP NP_Dup1: cap,100.00nF,+/-10%,10V,X5R,C0201; Part Reference: C1203; Manufacturer: TDK; RK PN: C0603X5R1A104K030BC; Priority: A; Tolerance: 10%; Value: 100nF; Part Type: C0201; Manufacturer PN: C0603X5R1A104K030BC; Created by: JJJ
C?#5 = CAP NP_Dup1: cap,100.00nF,+/-10%,10V,X5R,C0201; Part Reference: C1204; Manufacturer: TDK; RK PN: C0603X5R1A104K030BC; Priority: A; Tolerance: 10%; Value: 100nF; Part Type: C0201; Manufacturer PN: C0603X5R1A104K030BC; Created by: JJJ
C?#6 = CAP NP_Dup1: cap,100.00nF,+/-10%,10V,X5R,C0201; Part Reference: C1205; Manufacturer: TDK; RK PN: C0603X5R1A104K030BC; Priority: A; Tolerance: 10%; Value: 100nF; Part Type: C0201; Manufacturer PN: C0603X5R1A104K030BC; Created by: JJJ
C?#7 = CAP NP_Dup1: cap,1.00uF,+/-20%,6.3V,X5R,C0201; Part Reference: C1206; Manufacturer PN: C0603X5R0J105M030BC; Manufacturer: TDK; Tolerance: 20%; Priority: A; Value: 1uF; Created by: JJJ; Part Type: C0201; RK PN: C0603X5R0J105M030BC
C?#8 = CAP NP_Dup1: cap,10.00uF,+/-20%,4V,X5R,C0402; Part Reference: C1207; Manufacturer: YAGEO; RK PN: CC0402MRX5R4BB106; Priority: A; C_Voltage: 6.3V; Tolerance: 20%; Value: 10uF; Part Type: C0402; Manufacturer PN: CC0402MRX5R4BB106; Created by: JJJ
C?#9 = CAP NP_Dup1: cap,1.00uF,+/-20%,6.3V,X5R,C0201; Part Reference: C1208; Manufacturer: TDK; RK PN: C0603X5R0J105M030BC; Priority: A; Tolerance: 20%; Value: 1uF; Part Type: C0201; Manufacturer PN: C0603X5R0J105M030BC; Created by: JJJ
C?#10 = CAP NP_Dup1: cap,1.00uF,+/-20%,6.3V,X5R,C0201; Part Reference: C1209; Manufacturer PN: C0603X5R0J105M030BC; Manufacturer: TDK; Tolerance: 20%; Priority: A; Value: 1uF; Created by: JJJ; Part Type: C0201; RK PN: C0603X5R0J105M030BC
C?#11 = CAP NP_Dup1: cap,100.00nF,+/-10%,10V,X5R,C0201; Part Reference: C1210; Manufacturer PN: C0603X5R1A104K030BC; Manufacturer: TDK; Tolerance: 10%; Priority: A; Value: 100nF; Created by: JJJ; Part Type: C0201; RK PN: C0603X5R1A104K030BC
C?#12 = CAP NP_Dup1: cap,100.00nF,+/-10%,10V,X5R,C0201; Part Reference: C1211; Manufacturer PN: C0603X5R1A104K030BC; Manufacturer: TDK; Tolerance: 10%; Priority: A; Value: 100nF; Created by: JJJ; Part Type: C0201; RK PN: C0603X5R1A104K030BC
C?#13 = CAP NP_Dup1: cap,100.00nF,+/-10%,10V,X5R,C0201; Part Reference: C1212; Manufacturer PN: C0603X5R1A104K030BC; Manufacturer: TDK; Tolerance: 10%; Priority: A; Value: 100nF; Created by: JJJ; Part Type: C0201; RK PN: C0603X5R1A104K030BC
C?#14 = CAP NP_Dup1: cap,1.00uF,+/-20%,6.3V,X5R,C0201; Part Reference: C1213; Manufacturer PN: C0603X5R0J105M030BC; Manufacturer: TDK; Tolerance: 20%; Priority: A; PCB Footprint: C0201; Value: 1uF; Created by: JJJ; Part Type: C0201; RK PN: C0603X5R0J105M030BC
C?#15 = CAP NP_Dup1: cap,10.00uF,+/-10%,6.3V,X5R,C0603; Part Reference: C1232; Manufacturer: TDK; RK PN: C1608X5R0J106K080AB; Priority: A; Tolerance: 10%; PCB Footprint: C0603; Value: 10uF; Part Type: C0603; Manufacturer PN: C1608X5R0J106K080AB; Created by: JJJ
C?#16 = CAP NP_Dup1: cap,1.00uF,+/-20%,6.3V,X5R,C0201; Part Reference: C1214; Manufacturer: TDK; RK PN: C0603X5R0J105M030BC; Priority: A; Tolerance: 20%; PCB Footprint: C0201; Value: 1uF; Part Type: C0201; Manufacturer PN: C0603X5R0J105M030BC; Created by: JJJ
C?#17 = CAP NP_Dup1: cap,1.00uF,+/-20%,6.3V,X5R,C0201; Part Reference: C1215; Manufacturer PN: C0603X5R0J105M030BC; Manufacturer: TDK; Tolerance: 20%; Priority: A; PCB Footprint: C0201; Value: 1uF; Created by: JJJ; Part Type: C0201; RK PN: C0603X5R0J105M030BC
C?#18 = CAP NP_Dup1: cap,1.00uF,+/-20%,6.3V,X5R,C0201; Part Reference: C1216; Manufacturer PN: C0603X5R0J105M030BC; Manufacturer: TDK; Tolerance: 20%; Priority: A; Value: 1uF; Created by: JJJ; Part Type: C0201; RK PN: C0603X5R0J105M030BC
C?#19 = CAP NP_Dup1: cap,1.00uF,+/-20%,6.3V,X5R,C0201; Part Reference: C1219; Manufacturer: TDK; RK PN: C0603X5R0J105M030BC; Priority: A; Tolerance: 20%; Value: 1uF; Part Type: C0201; Manufacturer PN: C0603X5R0J105M030BC; Created by: JJJ
C?#20 = CAP NP_Dup1: cap,1.00uF,+/-20%,6.3V,X5R,C0201; Part Reference: C1217; Manufacturer: TDK; RK PN: C0603X5R0J105M030BC; Priority: A; Tolerance: 20%; Value: 1uF; Part Type: C0201; Manufacturer PN: C0603X5R0J105M030BC; Created by: JJJ
C?#21 = CAP NP_Dup1: cap,1.00uF,+/-20%,6.3V,X5R,C0201; Part Reference: C1218; Manufacturer PN: C0603X5R0J105M030BC; Manufacturer: TDK; Tolerance: 20%; Priority: A; Value: 1uF; Created by: JJJ; Part Type: C0201; RK PN: C0603X5R0J105M030BC
C?#22 = CAP NP_Dup1: cap,10.00uF,+/-20%,4V,X5R,C0402; Part Reference: C1220; Manufacturer: YAGEO; RK PN: CC0402MRX5R4BB106; Priority: A; Tolerance: 20%; Value: 10uF; Part Type: C0402; Manufacturer PN: CC0402MRX5R4BB106; Created by: JJJ
C?#23 = CAP NP_Dup1: cap,4.70uF,+/-10%,6.3V,X5R,C0402; Part Reference: C1221; Manufacturer PN: C1005X5R0J475K050BC; Manufacturer: TDK; Tolerance: 10%; Priority: A; Value: 4.7uF; Created by: JJJ; Part Type: C0402; RK PN: C1005X5R0J475K050BC
C?#24 = CAP NP_Dup1: cap,100.00nF,+/-10%,10V,X5R,C0201; Part Reference: C1223; Manufacturer PN: C0603X5R1A104K030BC; Manufacturer: TDK; Tolerance: 10%; Priority: A; Value: 100nF; Created by: JJJ; Part Type: C0201; RK PN: C0603X5R1A104K030BC
C?#25 = CAP NP_Dup1: cap,1.00uF,+/-20%,6.3V,X5R,C0201; Part Reference: C1224; Manufacturer PN: C0603X5R0J105M030BC; Manufacturer: TDK; Tolerance: 20%; Priority: A; PCB Footprint: C0201; Value: 1uF; Created by: JJJ; Part Type: C0201; RK PN: C0603X5R0J105M030BC
C?#26 = CAP NP_Dup1: cap,100.00nF,+/-10%,10V,X5R,C0201; Part Reference: C1225; Manufacturer: TDK; RK PN: C0603X5R1A104K030BC; Priority: A; Tolerance: 10%; PCB Footprint: C0201; Value: 100nF; Part Type: C0201; Manufacturer PN: C0603X5R1A104K030BC; Created by: JJJ
C?#27 = CAP NP_Dup1: cap,10.00uF,+/-20%,4V,X5R,C0402; Part Reference: C1226; Manufacturer PN: CC0402MRX5R4BB106; Manufacturer: YAGEO; Tolerance: 20%; Priority: A; Value: 10uF; Created by: JJJ; Part Type: C0402; RK PN: CC0402MRX5R4BB106
C?#28 = CAP NP_Dup1: cap,4.70uF,+/-10%,6.3V,X5R,C0402; Part Reference: C1227; Manufacturer: TDK; RK PN: C1005X5R0J475K050BC; Priority: A; Tolerance: 10%; Value: 4.7uF; Part Type: C0402; Manufacturer PN: C1005X5R0J475K050BC; Created by: JJJ
C?#29 = CAP NP_Dup1: cap,100.00nF,+/-10%,10V,X5R,C0201; Part Reference: C1229; Manufacturer: TDK; RK PN: C0603X5R1A104K030BC; Priority: A; Tolerance: 10%; Value: 100nF; Part Type: C0201; Manufacturer PN: C0603X5R1A104K030BC; Created by: JJJ
C?#30 = CAP NP_Dup1: cap,1.00uF,+/-20%,6.3V,X5R,C0201; Part Reference: C1228; Manufacturer PN: C0603X5R0J105M030BC; Manufacturer: TDK; Tolerance: 20%; Priority: A; Value: 1uF; Created by: JJJ; Part Type: C0201; RK PN: C0603X5R0J105M030BC
C?#31 = CAP NP_Dup1: cap,100.00nF,+/-10%,10V,X5R,C0201; Part Reference: C1231; Manufacturer PN: C0603X5R1A104K030BC; Manufacturer: TDK; Tolerance: 10%; Priority: A; Value: 100nF; Created by: JJJ; Part Type: C0201; RK PN: C0603X5R1A104K030BC
R?#1 = RESISTOR_Dup2: НЁУГєсД¤µзЧи,240R,+/-1%,R0201,1/20W.; Part Reference: R1200; Manufacturer: YAGEO; RK PN: RC0201FR-07240RL; Priority: A; Wattage: 1/20W; Value: 240R; Part Type: НЁУГєсД¤µзЧи; Manufacturer PN: RC0201FR-07240RL; Created by: YTL
R?#2 = RESISTOR_Dup2: НЁУГєсД¤µзЧи,240R,+/-1%,R0201,1/20W.; Part Reference: R1202; Manufacturer: YAGEO; RK PN: RC0201FR-07240RL; Priority: A; Wattage: 1/20W; Value: 240R; Part Type: НЁУГєсД¤µзЧи; Manufacturer PN: RC0201FR-07240RL; Created by: YTL
R?#3 = RESISTOR_Dup2: НЁУГєсД¤µзЧи,240R,+/-1%,R0201,1/20W.; Part Reference: R1201; Manufacturer: YAGEO; RK PN: RC0201FR-07240RL; Priority: A; Wattage: 1/20W; Value: 240R; Part Type: НЁУГєсД¤µзЧи; Manufacturer PN: RC0201FR-07240RL; Created by: YTL
R?#4 = RESISTOR_Dup2: НЁУГєсД¤µзЧи,240R,+/-1%,R0201,1/20W.; Part Reference: R1203; Manufacturer PN: RC0201FR-07240RL; Manufacturer: YAGEO; Wattage: 1/20W; Priority: A; Value: 240R; Created by: YTL; Part Type: НЁУГєсД¤µзЧи; RK PN: RC0201FR-07240RL
U?#1 U?#2 = SOC_RK3588: ROCKCHIP SOC; Part Reference: U1000; Manufacturer: Rockchip (ИрРѕОў); SWAP_INFO: (S1+S2+S3+S4+S5+S6+S7+S8+S9+S10+S11+S12+S13+S14+S15+S16+S17+S18+S19+S20+S21+S22+S23+S24+S25+S26); SPLIT_INST: TRUE; Priority: A; Value: RK3588; Created by: YWQ; Manufacturer PN: RK3588; Part Type: SOC; RK PN: RK3588; PCB Footprint: BGA1088_23R00X23R00X2R00